# EAGLE design SparkFun-ESP8266-WiFi-Shield (EAGLE 7.1.0)
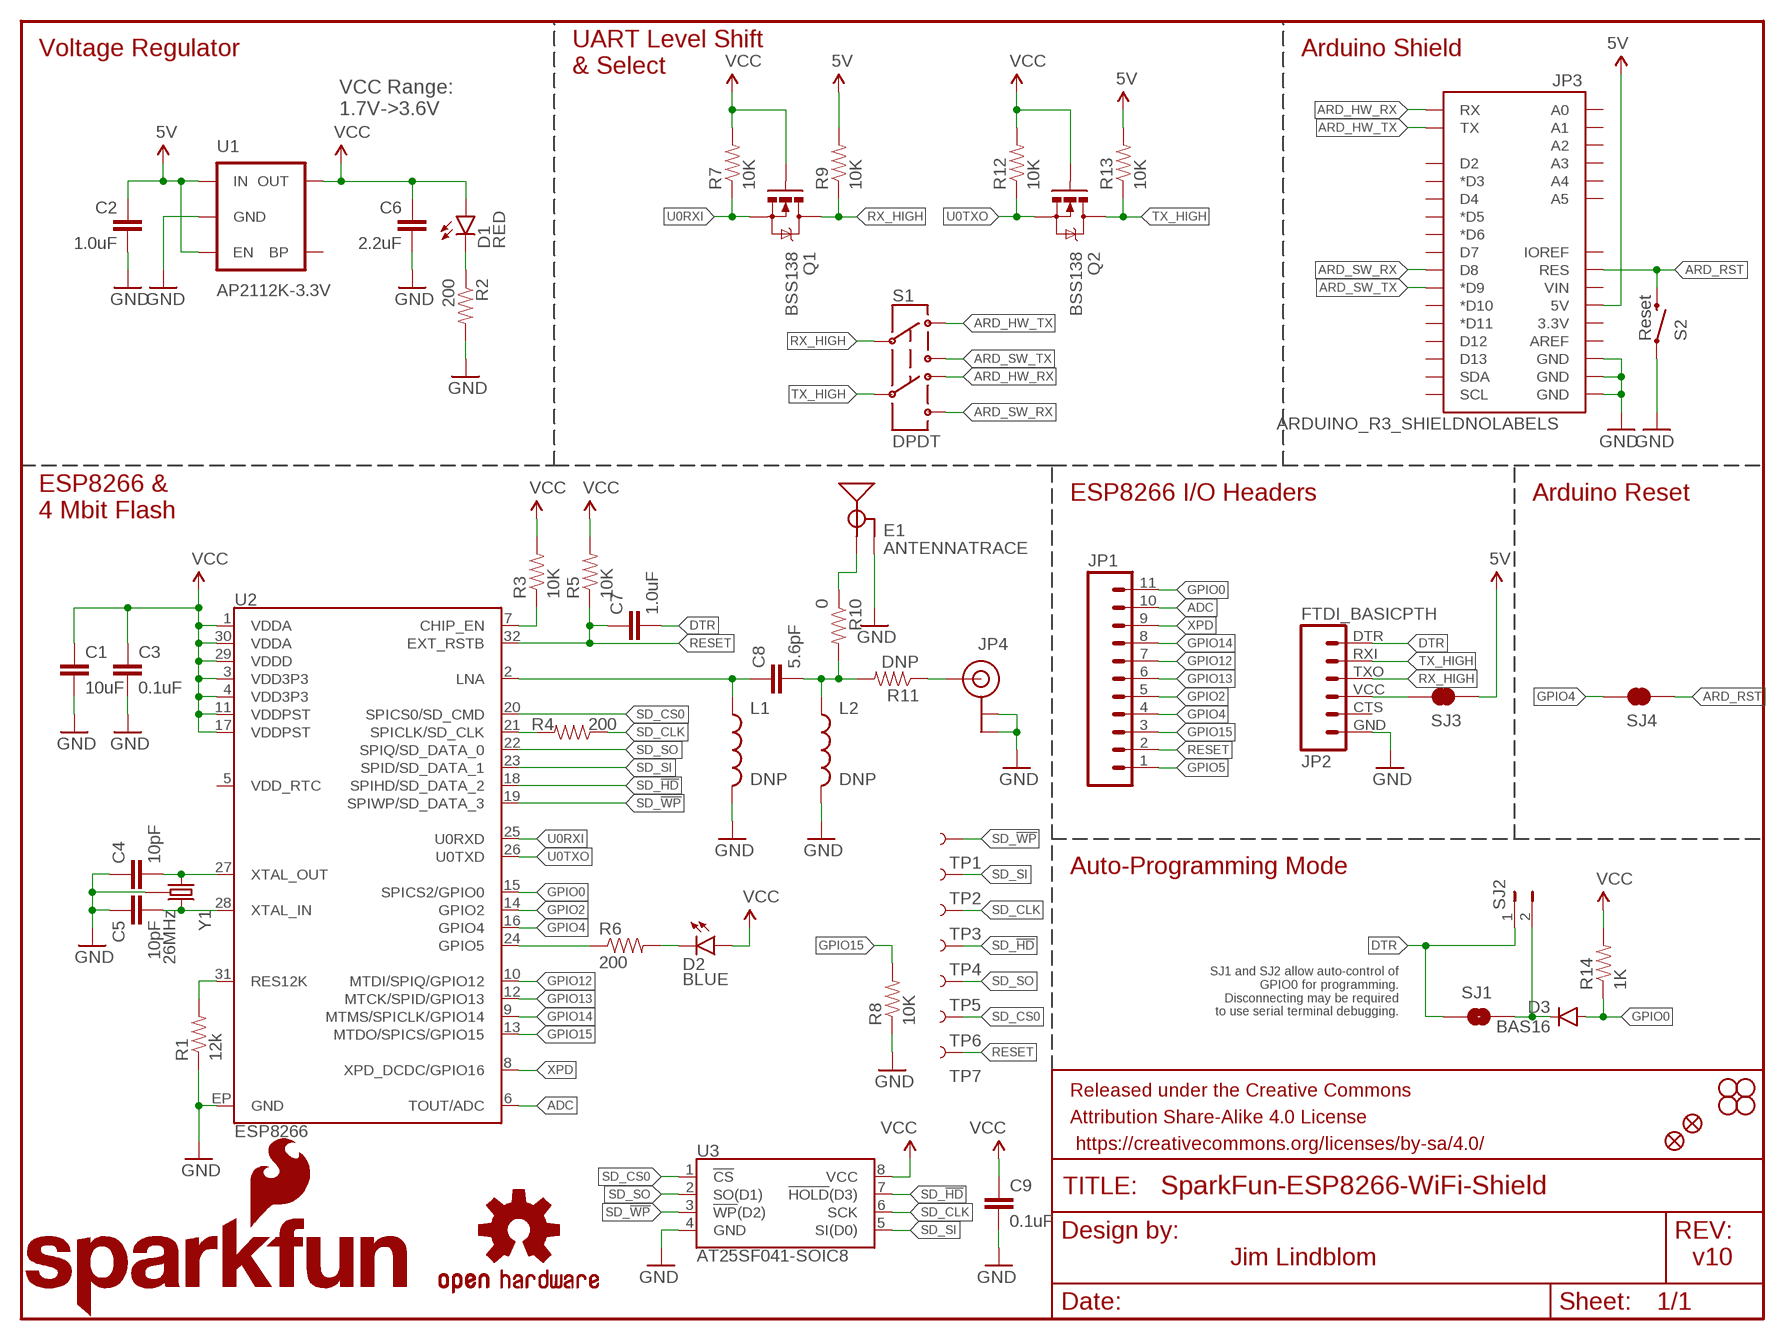
[diagram p0: schematic, sheet 1]

## Parts
C1  10uF  10UF-6.3V-20%(0603)  [0603-CAP]
C2  1.0uF  1.0UF-25V-+80/-20(0805)  [0805]
C3  0.1uF  0.1UF-25V(+80/-20%)(0603)  [0603-CAP]
C4  10pF  10PF-50V-5%(0603)  [0603-CAP]
C5  10pF  10PF-50V-5%(0603)  [0603-CAP]
C6  2.2uF  2.2UF-10V-20%(0603)  [0603-CAP]
C7  1.0uF  1.0UF-16V-10%(0603)  [0603-CAP]
C8  5.6pF  CAP0603-CAP  [0603-CAP]
C9  0.1uF  0.1UF-25V(+80/-20%)(0603)  [0603-CAP]
D1  RED  LED-RED0603  [LED-0603]
D2  BLUE  LED-BLUE0603  [LED-0603]
D3  BAS16  DIODEBAS16  [SOD-323]
E1  ANTENNATRACE  [TRACE_ANTENNA_2.4GHZ_25.7MM]
FID1  FIDUCIAL1X2  [FIDUCIAL-1X2]
FID2  FIDUCIAL1X2  [FIDUCIAL-1X2]
FRAME1  FRAME-LETTER  [CREATIVE_COMMONS]
JP1  M11PTH  [1X11]
JP2  FTDI_BASICPTH  [FTDI_BASIC]
JP3  ARDUINO_R3_SHIELDNOLABELS  [UNO_R3_SHIELD_NOLABELS]
JP4  U.FL  [U.FL]
L1  DNP  INDUCTOR0603  [0603]
L2  DNP  INDUCTOR0603  [0603]
LOGO1  SFE_LOGO_NAME_FLAME.2_INCH  [SFE_LOGO_NAME_FLAME_.2]
LOGO2  OSHW-LOGOM  [OSHW-LOGO-M]
Q1  BSS138  MOSFET-NCHANNELBSS138  [SOT23-3]
Q2  BSS138  MOSFET-NCHANNELBSS138  [SOT23-3]
R1  12k  12KOHM-1/10W-1%(0603)  [0603-RES]
R2  200  200OHM1/10W1%(0603)  [0603-RES]
R3  10K  10KOHM1/10W1%(0603)0603  [0603-RES]
R4  200  200OHM1/10W1%(0603)  [0603-RES]
R5  10K  10KOHM1/10W1%(0603)0603  [0603-RES]
R6  200  200OHM1/10W1%(0603)  [0603-RES]
R7  10K  10KOHM1/10W1%(0603)0603  [0603-RES]
R8  10K  10KOHM1/10W1%(0603)0603  [0603-RES]
R9  10K  10KOHM1/10W1%(0603)0603  [0603-RES]
R10  0  0OHM1/10W5%(0603)  [0603]
R11  DNP  RESISTOR0603-RES  [0603-RES]
R12  10K  10KOHM1/10W1%(0603)0603  [0603-RES]
R13  10K  10KOHM1/10W1%(0603)0603  [0603-RES]
R14  1K  1KOHM1/10W1%(0603)  [0603-RES]
S1  DPDT  SWITCH-DPDTAYZ0202  [AYZ0202]
S2  Reset  SWITCH-MOMENTARY-2SMD  [TACTILE-SWITCH-SMD]
SJ1  JUMPER-PAD-2-NO  [PAD-JUMPER-2-NO_NO_SILK]
SJ2  JUMPER-PTH-2-NO  [PTH-JUMPER-2-NO_NO_SILK]
SJ3  JUMPER-PAD-2-NC_BY_TRACE  [PAD-JUMPER-2-NC_BY_TRACE_YES_SILK]
SJ4  JUMPER-PAD-2-NC_BY_TRACE  [PAD-JUMPER-2-NC_BY_TRACE_YES_SILK]
STANDOFF1  STAND-OFF  [STAND-OFF]
STANDOFF2  STAND-OFF  [STAND-OFF]
STANDOFF3  STAND-OFF  [STAND-OFF]
STANDOFF4  STAND-OFF  [STAND-OFF]
TP1  TEST-POINT3X5  [PAD.03X.05]
TP2  TEST-POINT3X5  [PAD.03X.05]
TP3  TEST-POINT3X5  [PAD.03X.05]
TP4  TEST-POINT3X5  [PAD.03X.05]
TP5  TEST-POINT3X5  [PAD.03X.05]
TP6  TEST-POINT3X5  [PAD.03X.05]
TP7  TEST-POINT3X5  [PAD.03X.05]
U1  AP2112K-3.3V  V_REG_LDOSMD  [SOT23-5]
U2  ESP8266  [QFN32]
U3  AT25SF041-SOIC8  [SO08]
Y1  26MHz  CRYSTAL-GROUNDED3.2X2.5  [CRYSTAL-SMD-3.2X2.5]

## Nets
5V: C2.1 JP3.5V R9.2 R13.2 SJ3.1 U1.1(IN) U1.3(EN)
ADC: JP1.10 U2.6(TOUT/ADC)
ANT: JP4.P$3(SIGNAL) R11.1
ARD_HW_RX: JP3.RX S1.4
ARD_HW_TX: JP3.TX S1.1
ARD_RST: JP3.RES S2.3 SJ4.1
ARD_SW_RX: JP3.D8 S1.6
ARD_SW_TX: JP3.D9(*D9) S1.3
CHIP_EN: R3.1 U2.7(CHIP_EN)
DTR: C7.2 JP2.DTR SJ1.1 SJ2.1
GND: C1.2 C2.2 C3.2 C4.1 C5.1 C6.2 C9.2 E1.GND E1.GND2(GND) JP2.GND JP3.GND@0(GND) JP3.GND@1(GND) JP3.GND@2(GND) JP4.P$1(GND) JP4.P$2(GND) L1.2 L2.2 R1.1 R2.2 R8.1 S2.1 U1.2(GND) U2.EP(GND) U3.4(GND) Y1.2(GND) Y1.4(GND)
GPIO0: D3.A JP1.11 R14.1 U2.15(SPICS2/GPIO0)
GPIO2: JP1.5 U2.14(GPIO2)
GPIO4: JP1.4 SJ4.2 U2.16(GPIO4)
GPIO5: JP1.1 R6.1 U2.24(GPIO5)
GPIO12: JP1.7 U2.10(MTDI/SPIQ/GPIO12)
GPIO13: JP1.6 U2.12(MTCK/SPID/GPIO13)
GPIO14: JP1.8 U2.9(MTMS/SPICLK/GPIO14)
GPIO15: JP1.3 R8.2 U2.13(MTDO/SPICS/GPIO15)
LNA: C8.1 L1.1 U2.2(LNA)
N$1: R1.2 U2.31(RES12K)
N$2: C5.2 U2.28(XTAL_IN) Y1.3
N$3: C4.2 U2.27(XTAL_OUT) Y1.1
N$4: D1.C R2.1
N$5: C8.2 L2.1 R10.2 R11.2
N$6: R4.2 U2.21(SPICLK/SD_CLK)
N$7: JP2.VCC SJ3.2
N$9: D2.C R6.2
RESET: C7.1 JP1.2 R5.1 TP7.P$1 U2.32(EXT_RSTB)
RX_HIGH: JP2.TXO Q1.3(D) R9.1 S1.2
SD_!HD!: TP4.P$1 U2.18(SPIHD/SD_DATA_2) U3.7(!HOLD!(D3))
SD_!WP!: TP1.P$1 U2.19(SPIWP/SD_DATA_3) U3.3(!WP!(D2))
SD_CLK: R4.1 TP3.P$1 U3.6(SCK)
SD_CS0: TP6.P$1 U2.20(SPICS0/SD_CMD) U3.1(!CS!)
SD_SI: TP2.P$1 U2.23(SPID/SD_DATA_1) U3.5(SI(D0))
SD_SO: TP5.P$1 U2.22(SPIQ/SD_DATA_0) U3.2(SO(D1))
SJ2: D3.C SJ1.2 SJ2.2
TRACE_ANT: E1.ANT(SIGNAL) R10.1
TX_HIGH: JP2.RXI Q2.3(D) R13.1 S1.5
U0RXI: Q1.2(S) R7.1 U2.25(U0RXD)
U0TXO: Q2.2(S) R12.1 U2.26(U0TXD)
VCC: C1.1 C3.1 C6.1 C9.1 D1.A D2.A Q1.1(G) Q2.1(G) R3.2 R5.2 R7.2 R12.2 R14.2 U1.5(OUT) U2.1(VDDA) U2.3(VDD3P3) U2.4(VDD3P3) U2.11(VDDPST) U2.17(VDDPST) U2.29(VDDD) U2.30(VDDA) U3.8(VCC)
XPD: JP1.9 U2.8(XPD_DCDC/GPIO16)
Unconnected: JP2.CTS JP3.3.3V JP3.A0 JP3.A1 JP3.A2 JP3.A3 JP3.A4 JP3.A5 JP3.AREF JP3.D2 JP3.D3(*D3) JP3.D4 JP3.D5(*D5) JP3.D6(*D6) JP3.D7 JP3.D10(*D10) JP3.D11(*D11) JP3.D12 JP3.D13 JP3.IOREF JP3.SCL JP3.SDA JP3.VIN U1.4(BP) U2.5(VDD_RTC)

## Notes on the sheet
- Voltage Regulator | Arduino Shield
- UART Level Shift
  & Select
- VCC Range:
  1.7V->3.6V
- ESP8266 I/O Headers | Arduino Reset
- ESP8266 &
  4 Mbit Flash
- Auto-Programming Mode
- SJ1 and SJ2 allow auto-control of
  GPIO0 for programming.
  Disconnecting may be required
  to use serial terminal debugging.
- Jim Lindblom | v10

## Library data of the parts
C1 = SparkFun-Capacitors:10UF-6.3V-20%(0603): CAP-11015; PROD_ID: CAP-11015
C2 = SparkFun-Capacitors:1.0UF-25V-+80/-20(0805): CAP-11625; PROD_ID: CAP-11625
C3 C9 = SparkFun-Capacitors:0.1UF-25V(+80/-20%)(0603): CAP-00810 Ceramic Standard decoupling cap; PROD_ID: CAP-00810
C4 C5 = SparkFun-Capacitors:10PF-50V-5%(0603): CAP-11812; PROD_ID: CAP-11812
C6 = SparkFun-Capacitors:2.2UF-10V-20%(0603): CAP-07888; PROD_ID: CAP-07888
C7 = SparkFun-Capacitors:1.0UF-16V-10%(0603): CAP-00868; PROD_ID: CAP-00868
C8 = SparkFun-Capacitors:CAP: Capacitor Standard 0603 ceramic capacitor, and 0.1" leaded capacitor.; PROD_ID: CAP-12456
D1 = SparkFun-LED:LED-RED: Assorted Red LEDs LilyPad 1206- DIO-09912 1206- DIO-00809 0603- DIO-00819; PROD_ID: DIO-00819
D2 = SparkFun-LED:LED-BLUE: Blue LEDs for production use Various blue LEDs stocked by SparkFun production 0603 - DIO-08575 Rebel - DIO-09553 1206 - DIO-09911; PROD_ID: DIO-08575
D3 = SparkFun-DiscreteSemi:DIODE: Diode These are standard reverse protection diodes and small signal diodes. SMA package can handle up to about 1A. SOD-323 can handle about 200mA. What the SOD-323 package when ordering, there are some mfgs out there that are 5-pin packages.; PROD_ID: DIO-09646; VALUE: 250mA/100V
E1 = esp8266-development-board:ANTENNA: Chip antenna Chip antenna with ground or secondary connection. Common with larger metal RF connectors.
FID1 FID2 = SparkFun-Aesthetics:FIDUCIAL: Fiducial Alignment Points Various fiducial points for machine vision alignment.
FRAME1 = SparkFun-Aesthetics:FRAME-LETTER: Schematic Frame Standard 8.5x11 US Letter frame; DESIGNER: Jim Lindblom; VERSION: v01
JP1 = SparkFun-Connectors:M11: Header 11 Standard 11-pin 0.1" header. Use with straight break away headers (SKU : PRT-00116), right angle break away headers (PRT-00553), swiss pins (PRT-00743), machine pins (PRT-00117), and female headers (PRT-00115).
JP2 = SparkFun-Connectors:FTDI_BASIC: FTDI Basic header with labels
JP3 = SparkFun-Boards:ARDUINO_R3_SHIELD: Shield form compatible with the Arduino Uno R3.
JP4 = SparkFun-Connectors:U.FL: SMD antenna connector- WRL-09144; PROD_ID: CONN-09193
L1 L2 = SparkFun-Passives:INDUCTOR: Inductors Basic Inductor/Choke - 0603 and 1206. Footprints are not proven and vary greatly between part numbers. SRN6045- 33uH, 20% 1.4A SDR0403-560KL - 56uH, 10%, 500mA RMS/740mA peak
LOGO1 = SparkFun-Aesthetics:SFE_LOGO_NAME_FLAME: SFE Logo, name and flame This is the SparkFun full logo. The logo on the schematic will always be the same size; the package variant is the height of the flame part of the logo. Default layer for the logo on the board is tSilk.
LOGO2 = SparkFun-Aesthetics:OSHW-LOGO: Open Source Hardware Logo This logo indicates the piece of hardware it is found on incorporates a OSHW license and/or adheres to the definition of open source hardware found here: http://freedomdefined.org/OSHW
Q1 Q2 = SparkFun-DiscreteSemi:MOSFET-NCHANNEL: Common NMOSFET Parts MFG P/N Store ID Prod ID FDD8780 TRANS-09984 SI7820DN TRANS-11055 FDS6630A IC-08089 2N7002PW TRANS-11151 FQP30N06L COM-10213 TRANS-10060 BSS123LT1G TRANS-08345 BSS138 TRANS-00830 BS170 2N7000; PROD_ID: TRANS-00830; VALUE: 200mA/50V
R1 = SparkFun-Resistors:12KOHM-1/10W-1%(0603): RES-10327; PROD_ID: RES-10327
R2 R4 R6 = SparkFun-Resistors:200OHM1/10W1%(0603): RES-08220; PROD_ID: RES-08220
R3 R5 R7-R9 R12 R13 = SparkFun-Resistors:10KOHM1/10W1%(0603): RES-00824; PROD_ID: RES-00824
R10 = SparkFun-Resistors:0OHM1/10W5%(0603): RES-08609; PROD_ID: RES-08609
R11 = SparkFun-Passives:RESISTOR: Resistor Basic schematic elements and footprints for 0603, 1206, and PTH resistors.
R14 = SparkFun-Resistors:1KOHM1/10W1%(0603): RES-07856; PROD_ID: RES-07856
S1 = SparkFun-Electromechanical:SWITCH-DPDT: DPDT Version of the COM-00597; PROD_ID: SWCH-08179
S2 = SparkFun-Electromechanical:SWITCH-MOMENTARY-2: Various NO switches- pushbuttons, reed, etc; PROD_ID: SWCH-08247
SJ1 = SparkFun-Passives:JUMPER-PAD-2-NO
SJ2 = SparkFun-Passives:JUMPER-PTH-2-NO
SJ3 SJ4 = SparkFun-Passives:JUMPER-PAD-2-NC_BY_TRACE
STANDOFF1-STANDOFF4 = SparkFun-Electromechanical:STAND-OFF: #4 Stand Off This is the mechanical footprint for a #4 phillips button head screw. Use the keepout ring to avoid running the screw head into surrounding components. SKU : PRT-00447
TP1-TP7 = SparkFun-Passives:TEST-POINT: Bare copper test points for troubleshooting or ICT
U1 = SparkFun-PowerIC:V_REG_LDO: Voltage Regulator LDO Standard 150mA LDO voltage regulator in SOT-23 layout. Micrel part MIC5205. BP (by-pass) pin is used to lower output noise with 470pF cap.; PROD_ID: VREG-12457
U2 = esp8266-development-board:ESP8266: Espressif ESP8266 WiFi Smart Connectivity Platform.; PROD_ID: IC-12452
U3 = esp8266-development-board:AT25SF041: SPI Serial Flash Memory with Dual/Quad-IO Support Example: Adesto Technologies AT25SF041-SSHD-T (1265-1131-1-ND) <http://www.digikey.com/product-detail/en/AT25SF041-SSHD-T/1265-1131-1-ND/4824165>; PROD_ID: IC-12455
Y1 = things:CRYSTAL-GROUNDED; PROD_ID: XTAL-12454

## Board
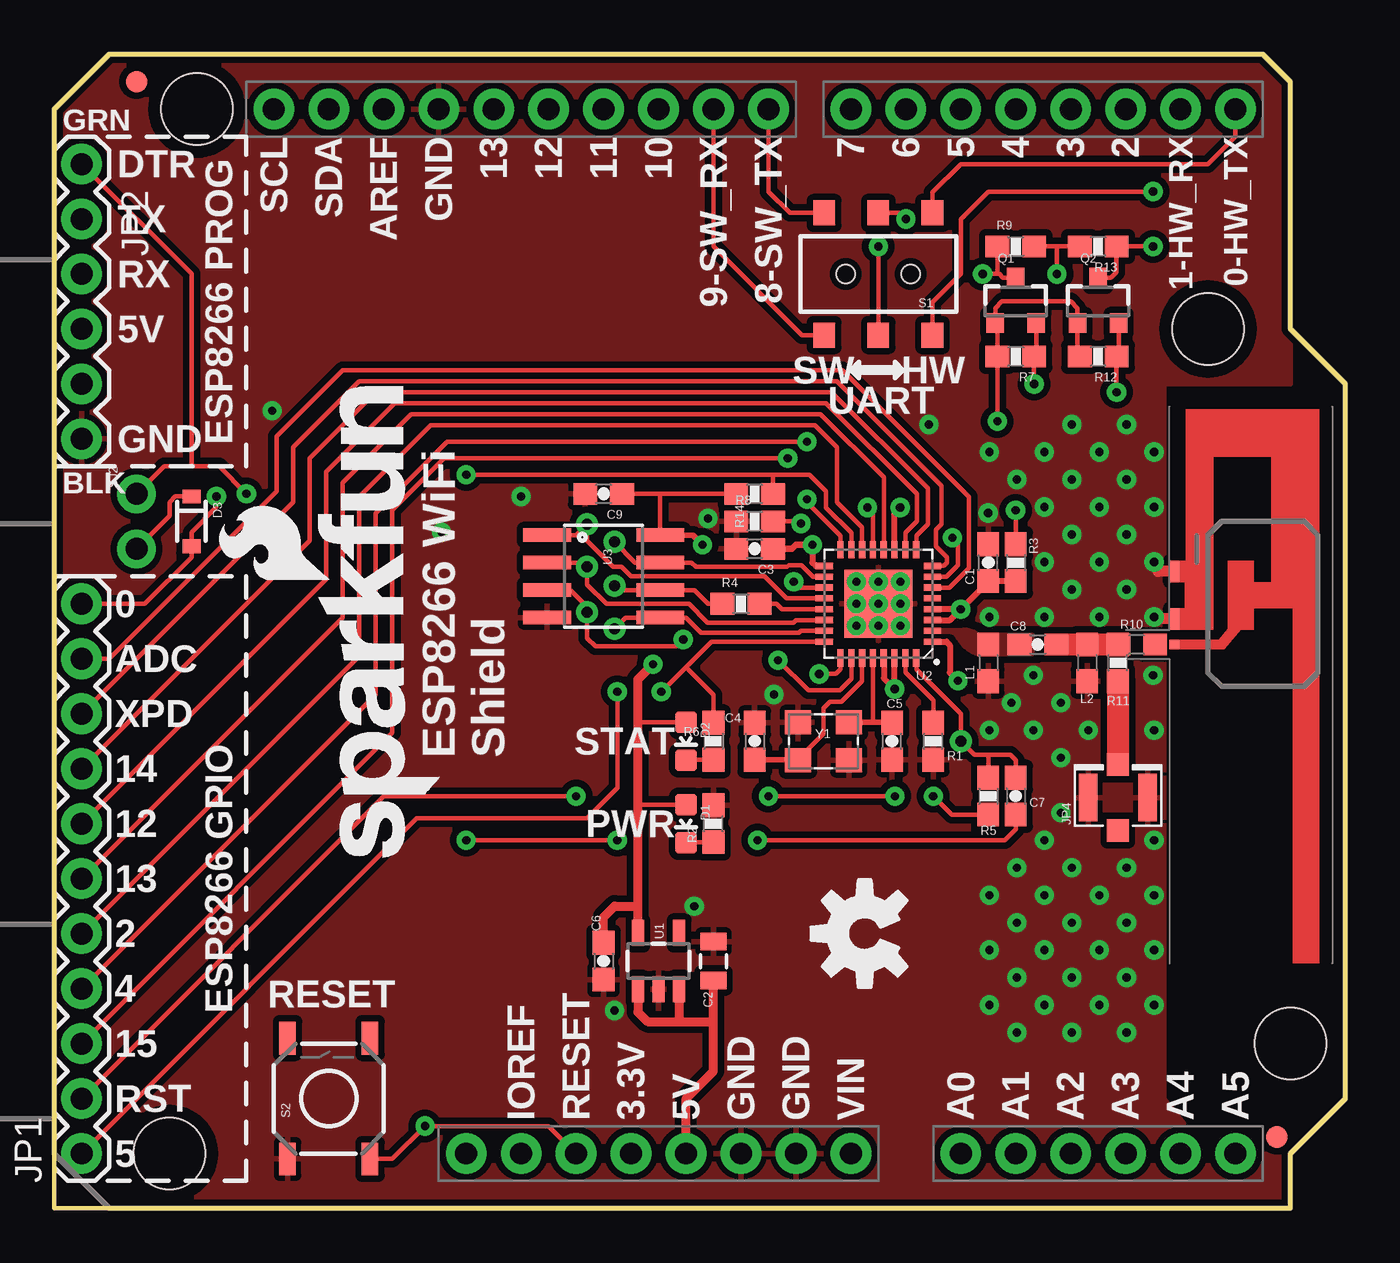
[diagram p1: board, top side]
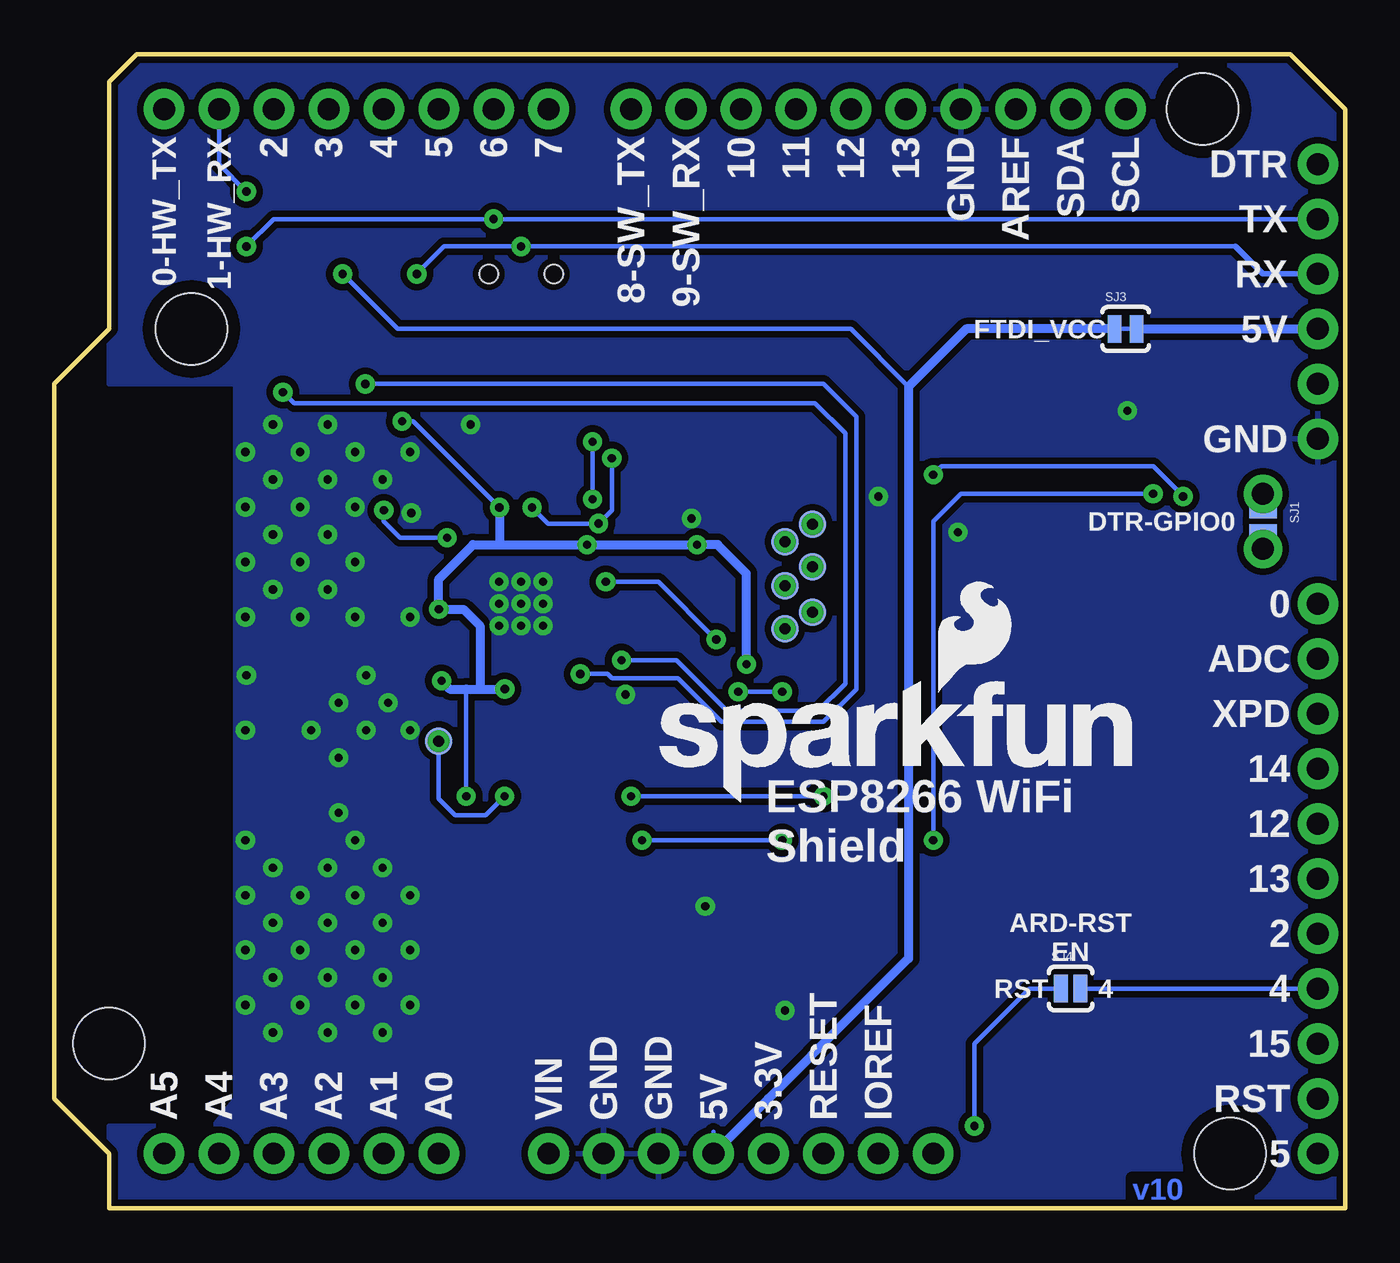
[diagram p2: board, bottom side, seen from below]

Size 59.69 x 53.34 mm. Coordinates in mm from the lower left corner, seen from the top.
Outline: 0,50.8 2.54,53.34 55.88,53.34 57.15,52.07 57.15,40.64 59.69,38.1 59.69,5.08 57.15,2.54 57.15,0 0,0 0,50.8
Copper layers (1*16): Top 0.035mm / dielectric 1.5mm / Bottom 0.035mm
Design rules "SparkFun-2-layer": minimum track width 7mil, minimum drill 15mil, track to track 8mil, track to pad 8mil, pad to pad 8mil, via to via 8mil, smd to smd 8mil, copper to edge 8mil, drill to drill 8mil, minimum pad ring 12mil, minimum via ring 10mil, stop-mask expansion 4mil, vias tented up to drill 20mil, thermal gap 10mil

### Footprints (pad centres in the part's own frame; a part is rotated, then mirrored left to right if it is on the bottom)
0603-CAP = smd 1.1 x 1: 1 -0.85,0; 2 0.85,0
0805 = smd 0.8 x 1.2: 1 -0.9,0; 2 0.9,0
LED-0603 = smd 1 x 1: A 0,-0.877; C 0,0.877
SOD-323 = smd 0.63 x 0.83: A 1.15,0; C -1.15,0
TRACE_ANTENNA_2.4GHZ_25.7MM = smd 0.46 x 0.46: ANT 0,0.23 | smd 1 x 0.46: GND -1.18,0.23; GND2 -3.38,0.23
FIDUCIAL-1X2 = smd 1 x 1: 1 0,0
1X11 = drill 1.016 pad 1.88: 1 0,0; 2 2.54,0; 3 5.08,0; 4 7.62,0; 5 10.16,0; 6 12.7,0; 7 15.24,0; 8 17.78,0; 9 20.32,0; 10 22.86,0; 11 25.4,0
FTDI_BASIC = drill 1.016 pad 1.88: CTS 10.16,0; DTR 0,0; GND 12.7,0; RXI 2.54,0; TXO 5.08,0; VCC 7.62,0
UNO_R3_SHIELD_NOLABELS = drill 1.016 pad 1.88: 3.3V 50.8,26.67; 5V 50.8,29.21; A0 50.8,41.91; A1 50.8,44.45; A2 50.8,46.99; A3 50.8,49.53; A4 50.8,52.07; A5 50.8,54.61; AREF 2.54,15.24; D2 2.54,49.53; D3 2.54,46.99; D4 2.54,44.45; D5 2.54,41.91; D6 2.54,39.37; D7 2.54,36.83; D8 2.54,33.02; D9 2.54,30.48; D10 2.54,27.94; D11 2.54,25.4; D12 2.54,22.86; D13 2.54,20.32; GND@0 50.8,31.75; GND@1 50.8,34.29; GND@2 2.54,17.78; IOREF 50.8,21.59; NC 50.8,19.05; RES 50.8,24.13; RX 2.54,54.61; SCL 2.54,10.16; SDA 2.54,12.7; TX 2.54,52.07; VIN 50.8,36.83
U.FL = smd 2.2 x 0.85: P$1 0,1.375; P$2 0,-1.375 | smd 1.05 x 1: P$3 1.525,0; P$4 -1.525,0
0603 = smd 1.1 x 1: 1 -0.85,0; 2 0.85,0
SOT23-3 = smd 0.8 x 0.9: 1 -0.95,-1; 2 0.95,-1; 3 0,1.1
0603-RES = smd 1.1 x 1: 1 -0.85,0; 2 0.85,0
AYZ0202 = smd 1 x 1.15: 1 -2.5,2.825; 2 0,2.825; 3 2.5,2.825; 4 -2.5,-2.825; 5 0,-2.825; 6 2.5,-2.825 | hole 0.85: 1.5,0; -1.5,0
TACTILE-SWITCH-SMD = smd 1.524 x 0.762: 1 -2.794,1.905; 2 2.794,1.905; 3 -2.794,-1.905; 4 2.794,-1.905
PAD-JUMPER-2-NO_NO_SILK = smd 0.635 x 1.27: 1 -0.45,0; 2 0.45,0
PTH-JUMPER-2-NO_NO_SILK = drill 1.016 pad 1.778: 1 -1.27,0; 2 1.27,0
PAD-JUMPER-2-NC_BY_TRACE_YES_SILK = smd 0.635 x 1.27: 1 -0.508,0; 2 0.508,0
PAD-JUMPER-2-NO_YES_SILK = smd 0.635 x 1.27: 1 -0.45,0; 2 0.45,0
STAND-OFF = hole 3.302: 0,0
PAD.03X.05 = smd 1.27 x 1.27: P$1 0,0
SOT23-5 = smd 0.55 x 1.2: 1 -0.95,-1.3; 2 0,-1.3; 3 0.95,-1.3; 4 0.95,1.3; 5 -0.95,1.3
QFN32 = smd 0.8 x 0.285: 1 -2.5,1.75; 2 -2.5,1.25; 3 -2.5,0.75; 4 -2.5,0.25; 5 -2.5,-0.25; 6 -2.5,-0.75; 7 -2.5,-1.25; 8 -2.5,-1.75; 17 2.5,-1.75; 18 2.5,-1.25; 19 2.5,-0.75; 20 2.5,-0.25; 21 2.5,0.25; 22 2.5,0.75; 23 2.5,1.25; 24 2.5,1.75 | smd 0.285 x 0.8: 9 -1.75,-2.5; 10 -1.25,-2.5; 11 -0.75,-2.5; 12 -0.25,-2.5; 13 0.25,-2.5; 14 0.75,-2.5; 15 1.25,-2.5; 16 1.75,-2.5; 25 1.75,2.5; 26 1.25,2.5; 27 0.75,2.5; 28 0.25,2.5; 29 -0.25,2.5; 30 -0.75,2.5; 31 -1.25,2.5; 32 -1.75,2.5 | smd 3.15 x 3.15: EP 0,0
SO08 = smd 0.61 x 2.21: 1 -1.905,-2.616; 2 -0.635,-2.616; 3 0.635,-2.616; 4 1.905,-2.616; 5 1.905,2.616; 6 0.635,2.616; 7 -0.635,2.616; 8 -1.905,2.616
CRYSTAL-SMD-3.2X2.5 = smd 1.2 x 1.1: 1 -1.175,-0.875; 2 1.175,-0.875; 3 1.175,0.875; 4 -1.175,0.875

### Placement (x,y rotation side)
C1  43.18,29.84 90 top
C2  30.48,11.43 90 top
C3  32.38,30.48 180 top
C4  32.38,21.59 270 top
C5  38.73,21.59 90 top
C6  25.4,11.43 270 top
C7  44.45,19.05 270 top
C8  45.47,26.06 0 top
C9  25.4,33.02 180 top
D1  29.21,17.78 180 top
D2  29.21,21.59 180 top
D3  6.35,31.75 270 top
E1  51.56,26.06 270 top
FID1  56.52,3.3 0 top
FID2  3.81,52.07 0 top
FRAME1  -2.03,-23.62 0 top  (outside the outline)
JP1  1.27,2.54 90 top
JP2  1.27,48.26 270 top
JP3  0,53.34 270 top
JP4  49.17,18.99 90 top
L1  43.18,25.21 270 top
L2  47.75,25.21 270 top
LOGO1  17.91,15.49 90 top
LOGO2  37.47,12.7 90 top
LOGO3  SFE_LOGO_NAME_FLAME.2_INCH  [SFE_LOGO_NAME_FLAME_.2]  32.38,18.67 0 bottom
Q1  44.45,41.91 0 top
Q2  48.26,41.91 0 top
R1  40.64,21.59 90 top
R2  30.48,17.78 90 top
R3  44.45,29.84 270 top
R4  31.75,27.94 0 top
R5  43.18,19.05 270 top
R6  30.48,21.59 270 top
R7  44.45,39.37 180 top
R8  32.38,31.75 0 top
R9  44.45,44.45 0 top
R10  50.04,26.06 180 top
R11  49.17,25.21 90 top
R12  48.26,39.37 180 top
R13  48.26,44.45 180 top
R14  32.38,33.02 180 top
S1  38.1,43.18 180 top
S2  12.7,5.08 90 top
SJ1  3.81,31.75 270 bottom
SJ2  3.81,31.75 270 top
SJ3  10.16,40.64 0 bottom
SJ4  [PAD-JUMPER-2-NO_YES_SILK]  12.7,10.16 0 bottom
STANDOFF1  53.34,40.64 0 top
STANDOFF2  6.6,50.8 0 top
STANDOFF3  57.15,7.62 0 top
STANDOFF4  5.33,2.54 0 top
TP1  24.64,27.56 0 bottom
TP2  25.91,26.8 0 bottom
TP3  25.91,28.77 0 bottom
TP4  25.91,30.8 0 bottom
TP5  24.64,29.65 0 bottom
TP6  24.64,31.62 0 bottom
TP7  41.91,21.59 0 bottom
U1  27.94,11.43 0 top
U2  38.1,27.94 180 top
U3  25.4,29.21 270 top
Y1  35.56,21.59 0 top

### Tracks (layer width: path | path; a pad name or v marks a point on that pad's centre or on a via)
5V  (via drill 0.38)
  Top 0.203: 46.35,44.45 R9.2 | v46.35,43.18 46.35,44.45 | 46.35,44.45 R13.2
  Top 0.406: JP3.5V 29.21,5.08 30.48,6.35 30.48,8.64 | U1.1 26.99,9.08 27.43,8.64 28.89,8.64 | 30.48,8.64 C2.1 | 28.89,8.64 30.48,8.64 | U1.3 28.89,8.64
  Bottom 0.203: 29.21,3.56 JP3.5V | 20.19,37.97 22.86,40.64 43.81,40.64 v46.35,43.18
  Bottom 0.406: 26.67,5.08 JP3.5V 20.19,11.56 20.19,37.97 17.53,40.64 SJ3.1
ADC
  Top 0.203: U2.6 41.39,28.69 42.29,29.59 42.29,32.89 36.45,38.73 13.34,38.73 10.29,35.69 10.29,33.15 2.54,25.4 JP1.10
ANT
  Top 1.016: R11.1 JP4.P$3
ARD_HW_RX
  Top 0.203: JP3.RX 54.61,49.53 53.34,48.26 41.91,48.26 40.6,46.95 S1.4
ARD_HW_TX  (via drill 0.38)
  Top 0.203: v50.8,46.99 43.18,46.99 41.91,45.72 41.91,43.18 40.6,41.87 S1.1
  Bottom 0.203: JP3.TX 52.07,48.26 v50.8,46.99
ARD_RST  (via drill 0.38)
  Top 0.203: S2.3 15.62,2.29 v17.14,3.81 22.86,3.81 JP3.RES
  Bottom 0.203: v17.14,3.81 17.14,7.62 14.61,10.16 SJ4.1
ARD_SW_RX
  Top 0.203: S1.6 34.01,46.01 33.02,46.99 JP3.D8
ARD_SW_TX
  Top 0.203: S1.3 34.58,40.35 30.48,44.45 JP3.D9
CHIP_EN  (via drill 0.38)
  Top 0.203: U2.7 41.26,29.19 41.78,29.72 41.78,30.73 v41.53,30.99 | v44.45,32.26 R3.1
  Bottom 0.203: v41.53,30.99 43.69,30.99 44.45,31.75 v44.45,32.26
DTR  (via drill 0.38)
  Top 0.203: C7.2 44.45,17.53 43.94,17.02 v32.51,17.02 | v19.05,17.02 v26.04,17.02 | JP2.DTR 6.35,43.18 6.35,34.29 | SJ2.1 5.08,34.29 6.35,34.29 | 6.35,34.29 7.62,34.29 v8.89,33.02
  Bottom 0.203: v19.05,17.02 19.05,31.75 17.78,33.02 v8.89,33.02 | v32.51,17.02 v26.04,17.02 | SJ1.1 SJ2.1
GND  (via drill 0.38)
  Top 0.508: E1.GND2 51.04,29.44 | E1.GND 50.93,27.24 50.8,27.37
  other vias: 38.1,27.94 38.1,28.96 38.1,26.92 37.08,27.94 37.08,28.96 37.08,26.92 39.12,28.96 39.12,27.94 39.12,26.92 43.18,32.13 30.23,31.88 50.8,24.64 50.85,22.1 50.85,17.02 50.85,14.48 50.85,11.94 50.85,27.33 50.85,29.87 50.85,32.41 50.85,34.95 49.58,36.22 49.58,33.68 49.58,31.14 49.58,28.6 49.58,15.75 49.58,13.21 47.04,31.14 45.77,29.87 45.77,27.33 48.31,27.33 48.31,29.87 47.04,28.6 43.23,27.33 33.27,23.75 48.31,32.41 45.77,32.41 45.77,34.95 48.31,34.95 47.04,33.68 47.04,36.22 48.31,14.48 48.31,11.94 47.04,13.21 45.77,11.94 45.77,14.48 47.04,15.75 45.77,17.02 46.53,18.29 46.53,20.83 47.8,22.1 46.53,23.37 44.25,23.37 45.26,24.64 45.26,22.1 43.23,22.1 50.85,9.4 48.31,9.4 45.77,9.4 47.04,10.67 49.58,10.67 40.44,36.22 43.23,14.48 44.5,15.75 44.5,13.21 44.5,10.67 43.23,11.94 43.23,9.4 44.5,8.13 47.04,8.13 49.58,8.13 44.5,33.68 43.23,34.95 10.08,36.86 21.59,32.89 17.91,31.24 29.59,13.97 25.91,9.14
  pour Bottom (isolate 0.305, rank 6): 57.15,0 0,0 0,50.8 2.54,53.34 55.88,53.34 57.15,52.07 57.15,38.1 51.31,38.1 51.31,5.08 52.32,3.81 57.15,3.81
  pour Top (isolate 0.305, rank 6): 57.15,0 0,0 0,50.8 2.54,53.34 55.88,53.34 57.15,52.07 57.15,38.1 51.31,38.1 51.31,5.08 52.32,3.81 57.15,3.81
GPIO0  (via drill 0.38)
  Top 0.203: U2.15 36.85,31.22 35.69,32.38 35.69,33.15 34.92,33.91 33.23,33.91 | 33.23,33.91 v19.05,33.91 | R14.1 33.23,33.91 | JP1.11 4.19,27.94 6.35,30.1 D3.A 6.35,31.24 7.5,32.39 v7.5,32.9
  Bottom 0.203: v19.05,33.91 18.67,34.29 8.89,34.29 v7.5,32.9
GPIO2
  Top 0.203: U2.14 37.35,31.48 36.2,32.64 36.2,35.18 35.18,36.2 17.4,36.2 14.1,32.89 14.1,25.53 JP1.5
GPIO4  (via drill 0.38)
  Top 0.203: U2.16 36.35,31.09 34.8,32.64 v34.8,32.77 | v34.8,35.43 18.16,35.43 14.86,32.13 14.86,23.75 JP1.4
  Bottom 0.203: v34.8,32.77 v34.8,35.43 | SJ4.2 JP1.4
GPIO5  (via drill 0.38)
  Top 0.203: U2.24 30.38,26.19 29.21,25.02 | 29.21,25.02 v28.07,23.88 | R6.1 30.48,23.75 29.21,25.02 | v26.04,23.88 26.04,19.43 24.64,18.03 16.76,18.03 JP1.1
  Bottom 0.203: v28.07,23.88 v26.04,23.88
GPIO12
  Top 0.203: U2.10 39.35,31.22 39.88,31.75 39.88,33.02 35.69,37.21 15.75,37.21 12.57,34.04 12.57,29.08 JP1.7
GPIO13
  Top 0.203: U2.12 38.35,33.79 35.43,36.7 16.51,36.7 13.34,33.53 13.34,27.3 JP1.6
GPIO14
  Top 0.203: U2.9 39.85,31.09 40.39,31.62 40.39,33.27 35.94,37.72 14.86,37.72 11.81,34.67 11.81,30.86 JP1.8
GPIO15  (via drill 0.38)
  Top 0.203: U2.13 37.85,32.13 v37.59,32.38 | R8.2 34.42,31.75 v34.52,31.65 | v33.91,34.67 18.03,34.67 15.62,32.26 15.62,21.97 JP1.3
  Bottom 0.203: v37.59,32.38 36.85,31.65 v34.52,31.65 33.91,32.26 v33.91,34.67
LNA
  pour Top (isolate 0.012, rank 2, no thermals): 40.61,26.73 42.03,26.74 arc-45 42.71,26.5 45.21,26.5 45.21,25.61 42.71,25.61 arc-44 41.79,26.35 arc-25 41.79,26.36 arc71 41.41,26.64 40.61,26.64
N$1
  Top 0.203: U2.31 39.35,24.79 40.64,23.5 R1.2
N$2
  Top 0.203: U2.28 37.85,22.46 38.1,22.46
  Top 0.254: Y1.3 38.1,22.46 38.71,22.46 C5.2
N$3
  Top 0.203: U2.27 37.35,24.37 36.4,23.42 35.87,23.42 35.56,23.11 35.56,21.94 34.36,20.74
  Top 0.254: C4.2 34.36,20.74 Y1.1
N$4
  Top 0.203: R2.1 29.21,16.93 D1.C
N$5
  Top 1.016: C8.2 L2.1 R11.2 R10.2
N$6
  Top 0.203: U2.21 33.65,27.69 33.4,27.94 R4.2
N$7
  Bottom 0.406: SJ3.2 JP2.VCC
N$9
  Top 0.203: R6.2 29.24,20.74 D2.C
RESET  (via drill 0.38, 0.51)
  Top 0.203: U2.32 39.85,24.92 41.91,22.86 TP7.P$1 42.55,20.95 43.18,20.95 | 43.18,20.95 44.2,20.95 44.45,20.7 C7.1 | R5.1 43.18,20.95 | v24.13,19.05 15.24,19.05 JP1.2 | v38.86,19.05 v33.02,19.05
  Bottom 0.203: v38.86,19.05 39.75,18.16 41.15,18.16 41.91,18.92 TP7.P$1 | v33.02,19.05 v24.13,19.05
  other vias: 41.91,21.59
RX_HIGH  (via drill 0.38)
  Top 0.203: S1.2 v38.1,44.45 | Q1.3 43.86,43.01 43.69,43.18 v42.93,43.18 43.6,43.18 R9.1
  Bottom 0.203: 5.08,44.45 v38.1,44.45 41.66,44.45 v42.93,43.18
  Bottom 0.254: 5.08,44.45 3.81,43.18 JP2.TXO
SD_!HD!  (via drill 0.51)
  Top 0.203: U2.18 35.07,29.19 34.54,29.72 33.96,29.72 33.88,29.64 29.67,29.64 29.46,29.84 U3.7 26.86,29.84 TP4.P$1
  other vias: 25.91,30.8
SD_!WP!  (via drill 0.38, 0.51)
  Top 0.203: U2.19 34.45,28.69 v34.19,28.96 | v29.08,26.29 28.77,25.97 25.02,25.97 24.64,26.35 TP1.P$1 24.64,27.81 23.88,28.57 U3.3
  Bottom 0.203: v34.19,28.96 31.75,28.96 v29.08,26.29
  other vias: 24.64,27.56
SD_CLK  (via drill 0.51)
  Top 0.203: R4.1 30.23,27.94 29.59,28.57 U3.6 26.1,28.57 TP3.P$1
  other vias: 25.91,28.77
SD_CS0  (via drill 0.51)
  Top 0.203: U2.20 33.85,28.19 32.83,29.21 26.67,29.21 26.23,29.65 25.84,29.65 24.64,30.86 TP6.P$1 24.13,31.11 U3.1
  other vias: 24.64,31.62
SD_SI  (via drill 0.51)
  Top 0.203: U2.23 34.51,26.69 34.44,26.61 29.9,26.61 29.21,27.3 U3.5 26.42,27.3 TP2.P$1
  other vias: 25.91,26.8
SD_SO  (via drill 0.51)
  Top 0.203: U2.22 34.3,27.19 34.17,27.06 30.21,27.06 29.34,27.94 25.53,27.94 24.64,28.83 TP5.P$1 24.45,29.84 U3.2
  other vias: 24.64,29.65
SJ2
  Top 0.203: D3.C 5.59,32.9 5.33,32.64 5.33,32 SJ2.2
  Bottom 0.203: SJ2.2 SJ1.2
TRACE_ANT
  pour Top (no thermals): 50.8,25.65 50.8,26.47 51.44,26.47 arc30 51.64,26.19 51.64,25.92 arc30 51.45,25.65
TX_HIGH  (via drill 0.38)
  Top 0.203: S1.5 39.09,46.01 v39.37,45.72 | v50.8,44.45 R13.1 49.11,43.27 48.85,43.01 Q2.3
  Bottom 0.203: v50.8,44.45 49.53,45.72 v39.37,45.72 JP2.RXI
U0RXI  (via drill 0.38)
  Top 0.203: U2.25 36.35,24.92 36.13,24.7 v35.37,24.7 | Q1.2 45.4,39.47 R7.1 v45.3,38.1
  Bottom 0.203: v35.37,24.7 34.1,24.7 33.91,24.51 30.86,24.51 28.83,22.48 24.13,22.48 22.61,24 22.61,36.58 24.13,38.1 v45.3,38.1
U0TXO  (via drill 0.38)
  Top 0.203: U2.26 36.85,24.47 36.32,23.94 34.86,23.94 v33.47,25.34 | Q2.2 49.21,39.47 R12.1 v49.11,37.72
  Bottom 0.203: v33.47,25.34 30.92,25.34 28.57,22.99 24.38,22.99 23.11,24.26 23.11,35.81 24.51,37.21 48.6,37.21 v49.11,37.72
VCC  (via drill 0.38)
  Top 0.203: R12.2 47.31,39.47 Q2.1 47.31,41.59 46.99,41.91 43.81,41.91 43.5,41.59 Q1.1 43.6,40.81 R7.2 v43.6,36.37 | D1.A 26.99,18.66 26.99,19.05 | R5.2 41.49,18.2 v40.64,19.05 | R14.2 28.02,33.02 | 28.02,33.02 C9.1 | U3.8 28.02,33.02 | D2.A 26.99,22.47 26.99,22.86
  Top 0.254: C9.1 26.73,33.02 | v29.97,30.67 29.53,31.11 U3.8
  Top 0.279: U2.30 v38.85,24 38.35,24.5 U2.29 | U2.1 41.25,26.19 41.4,26.04 41.4,24.77 v41.78,24.38 | U2.11 38.85,32.13 v39.1,32.38 | R3.2 C1.1 43.18,28.96 v41.91,27.69 | 41.41,27.19 U2.3 41.41,27.19 v41.91,27.69 | v41.91,27.69 U2.4 | U2.17 35.21,29.69 35.05,29.84 v35.05,30.67
  Top 0.305: C3.1 34.1,30.48 34.29,30.67 v35.05,30.67
  Top 0.406: U1.5 26.99,13.97 | 26.99,13.97 26.99,19.05 26.99,22.86 26.99,24.45 v27.69,25.15 | C6.1 25.4,13.46 25.91,13.97 26.99,13.97
  Bottom 0.203: v40.64,19.05 40.64,24 | v39.1,32.38 43.09,36.37 v43.6,36.37
  Bottom 0.406: 40.01,24 40.64,24 41.4,24 v41.78,24.38 | 40.01,24 v38.85,24 | 40.01,24 40.01,26.92 40.77,27.69 v41.91,27.69 41.91,29.08 40.32,30.67 39.1,30.67 | v27.69,25.15 27.69,29.34 29.02,30.67 v29.97,30.67 v35.05,30.67 39.1,30.67 | v39.1,32.38 39.1,30.67
XPD
  Top 0.203: U2.8 41.12,29.69 41.27,29.84 41.27,30.1 40.77,30.61 40.77,31.37 41.02,31.62 41.02,33.4 36.2,38.23 14.1,38.23 11.05,35.18 11.05,32.64 JP1.9

### Text on the board
Bottom: v10
tPlace: GRN | SCL | SDA | AREF | GND | 13 | 12 | 11 | 10 | 9-SW_RX | 8-SW_TX | 7 | 6 | 5 | 4 | 3 | 2 | 1-HW_RX | 0-HW_TX | DTR | TX | RX | ESP8266 PROG | 5V | SW | HW | UART | GND | BLK | 0 | ADC | XPD | STAT | ESP8266 WiFi / Shield | 14 | 12 | PWR | 13 | ESP8266 GPIO | 2 | 4 | RESET | 15 | RST | IOREF | RESET | 3.3V | 5V | GND | GND | VIN | A0 | A1 | A2 | A3 | A4 | A5 | 5
bPlace: SCL | SDA | AREF | GND | 13 | 12 | 11 | 10 | 9-SW_RX | 8-SW_TX | 7 | 6 | 5 | 4 | 3 | 2 | 1-HW_RX | 0-HW_TX | DTR | TX | RX | 5V | FTDI_VCC | GND | DTR-GPIO0 | 0 | ADC | XPD | 14 | ESP8266 WiFi / Shield | 12 | 13 | 2 | ARD-RST / EN | 4 | 4 | RST | 15 | RST | IOREF | RESET | 3.3V | 5V | GND | GND | VIN | A0 | A1 | A2 | A3 | A4 | A5 | 5